# Altium project FEU31_Part2.PrjPcb
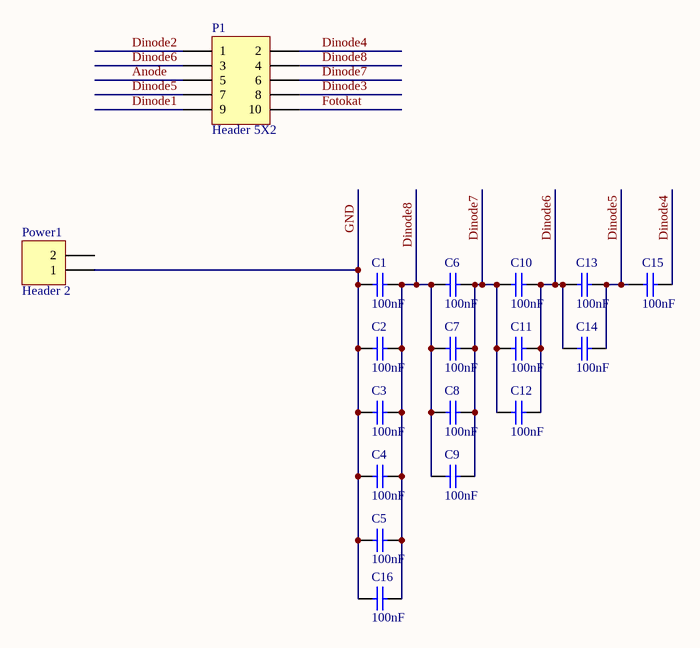
[diagram p0: FEU31_Part2.SchDoc]
1 sheet, 18 parts. Net scope: global (net labels, ports and power ports of the same name join across sheets).
Board file: FEU31_Part2.PcbDoc

## Sheet FEU31_Part2.SchDoc: Интерфейсный модуль ФЭУ-102
size A3; Address1: (с) Быканов Андрей; Address2: г.Тула 2016г.; Revision: 1.3

### Parts
C1  100nF  [C1206]
C2  100nF  [C1206]
C3  100nF  [C1206]
C4  100nF  [C1206]
C5  100nF  [C1206]
C6  100nF  [C1206]
C7  100nF  [C1206]
C8  100nF  [C1206]
C9  100nF  [C1206]
C10  100nF  [C1206]
C11  100nF  [C1206]
C12  100nF  [C1206]
C13  100nF  [C1206]
C14  100nF  [C1206]
C15  100nF  [C1206]
C16  100nF  [C1206]
P1  Header 5X2  [ФЭУ-31]
Power1  Header 2  [HDR1X2]

### Nets
Anode: P1.5
Dinode1: P1.9
Dinode2: P1.1
Dinode3: P1.8
Dinode4: C15.1 P1.2
Dinode5: C13.1 C14.1 C15.2 P1.7
Dinode6: C10.1 C11.1 C12.1 C13.2 C14.2 P1.3
Dinode7: C6.1 C7.1 C8.1 C9.1 C10.2 C11.2 C12.2 P1.6
Dinode8: C1.1 C2.1 C3.1 C4.1 C5.1 C6.2 C7.2 C8.2 C9.2 C16.1 P1.4
Fotokat: P1.10
GND: C1.2 C2.2 C3.2 C4.2 C5.2 C16.2 Power1.1

Not connected (* = marked no-connect by the designer): Power1 2

### Notes on the sheet
- Title
- Size:
- Date:
- A3
- Number:
- Time:
- Revision:
- Sheet
- of
- File:

### Library data of the parts
C1-C16 = Cap Semi: Capacitor (Semiconductor SIM Model); Order: CGA5L4X7T2W104K; Published: 8-Jun-2000; LatestRevisionDate: 29-May-2009; LatestRevisionNote: IPC-7351 Footprint Added.; PackageReference: C1206; Publisher: Altium Limited; PackageDescription: Chip Capacitor; Value: 100nF
P1 = Header 5X2: Header, 5-Pin, Dual row; LatestRevisionDate: 17-Jul-2002; LatestRevisionNote: Re-released for DXP Platform.; Publisher: Altium Limited
Power1 = Header 2: Header, 2-Pin; LatestRevisionDate: 17-Jul-2002; LatestRevisionNote: Re-released for DXP Platform.; Publisher: Altium Limited